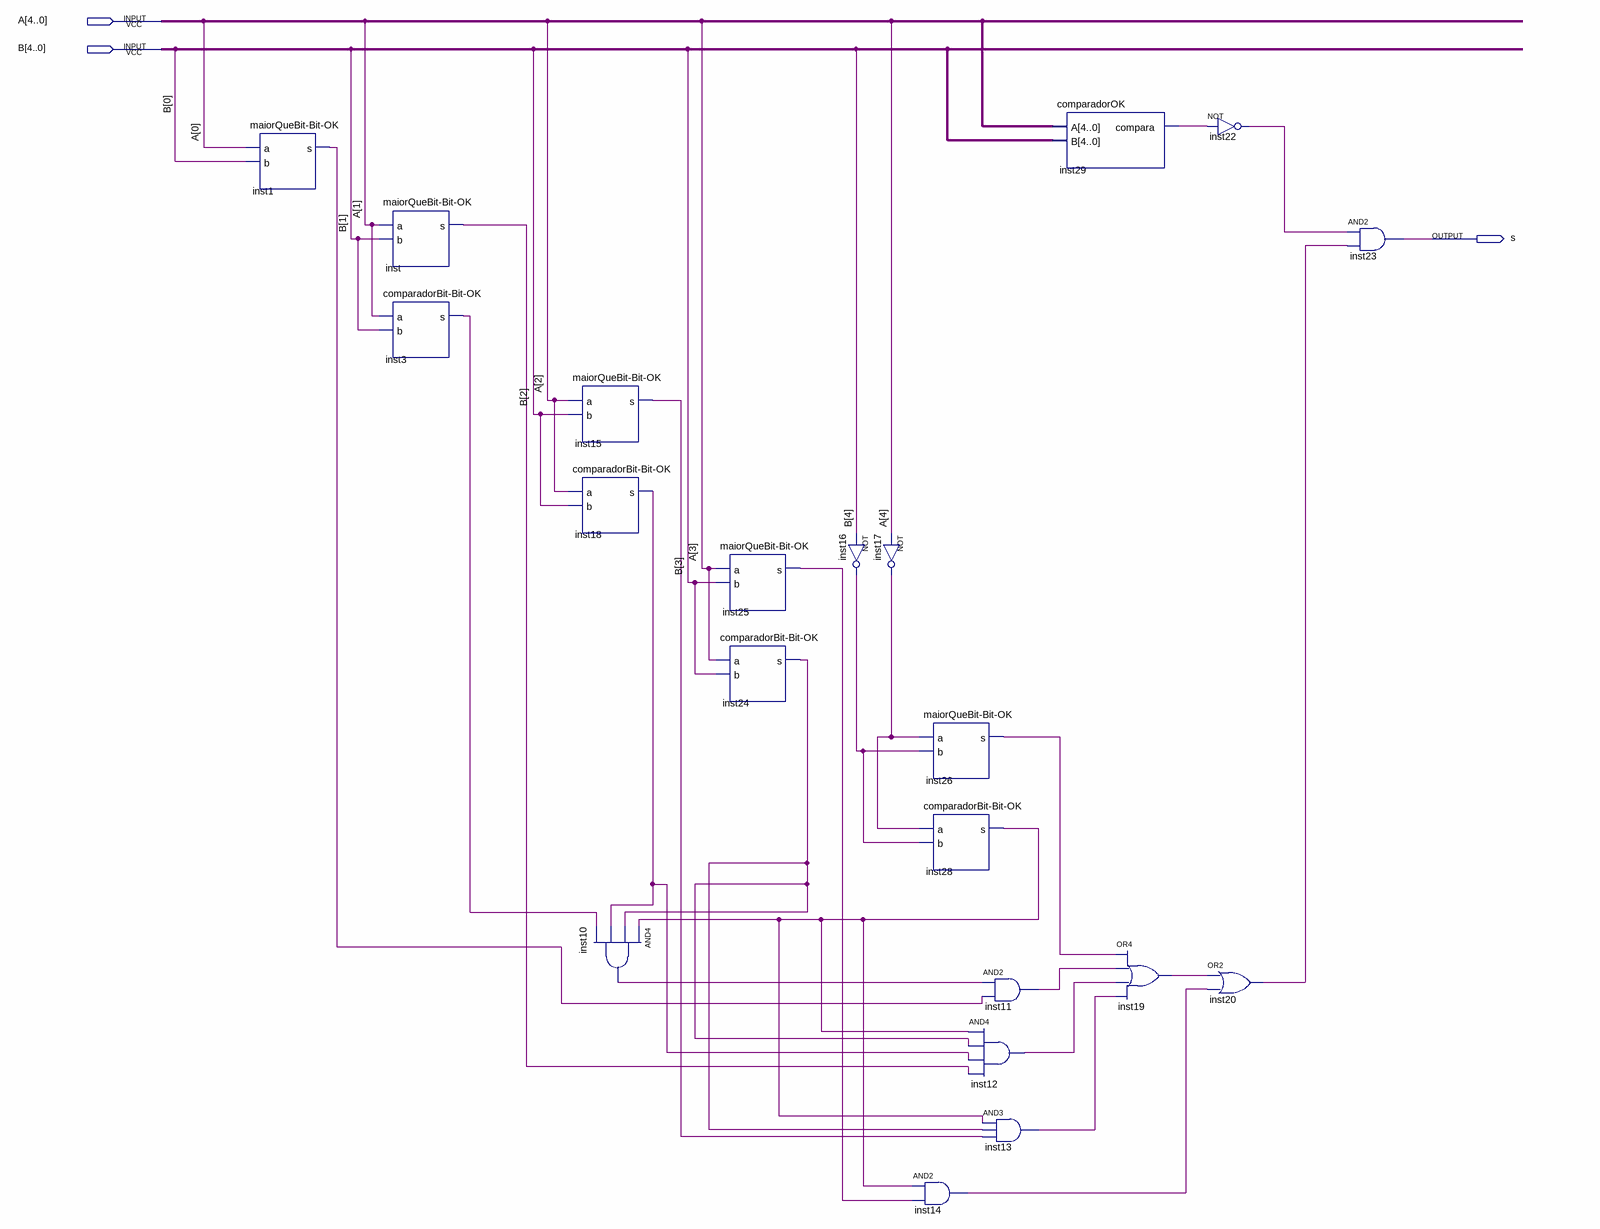
[diagram p0: schematic sheet]
// Quartus schematic maiorQueOK.bdf as structural Verilog: 21 symbols, 3 pins
module maiorQueOK (
  input  [4:0] A,
  input  [4:0] B,
  output s
);

  wire inst1_s, inst3_s, inst10_out, inst11_out, inst12_out, inst13_out, inst14_out, inst15_s, inst16_out,
       inst17_out, inst18_s, inst19_out, inst20_out, inst22_out, inst24_s, inst25_s, inst26_s, inst28_s,
       inst29_compara, inst_s;

  \maiorQueBit-Bit-OK  inst1 (.a(A[0]), .b(B[0]), .s(inst1_s));
  \maiorQueBit-Bit-OK  inst (.a(A[1]), .b(B[1]), .s(inst_s));
  \comparadorBit-Bit-OK  inst3 (.a(A[1]), .b(B[1]), .s(inst3_s));
  \maiorQueBit-Bit-OK  inst15 (.a(A[2]), .b(B[2]), .s(inst15_s));
  \comparadorBit-Bit-OK  inst18 (.a(A[2]), .b(B[2]), .s(inst18_s));
  and inst10 (inst10_out, inst28_s, inst24_s, inst18_s, inst3_s);
  \maiorQueBit-Bit-OK  inst25 (.a(A[3]), .b(B[3]), .s(inst25_s));
  \comparadorBit-Bit-OK  inst24 (.a(A[3]), .b(B[3]), .s(inst24_s));
  not inst16 (inst16_out, B[4]);
  not inst17 (inst17_out, A[4]);
  \maiorQueBit-Bit-OK  inst26 (.a(inst17_out), .b(inst16_out), .s(inst26_s));
  \comparadorBit-Bit-OK  inst28 (.a(inst17_out), .b(inst16_out), .s(inst28_s));
  and inst14 (inst14_out, inst28_s, inst25_s);
  and inst12 (inst12_out, inst28_s, inst24_s, inst18_s, inst_s);
  and inst11 (inst11_out, inst10_out, inst1_s);
  and inst13 (inst13_out, inst28_s, inst24_s, inst15_s);
  comparadorOK inst29 (.A(A), .B(B), .compara(inst29_compara));
  or inst19 (inst19_out, inst26_s, inst11_out, inst12_out, inst13_out);
  not inst22 (inst22_out, inst29_compara);
  or inst20 (inst20_out, inst19_out, inst14_out);
  and inst23 (s, inst22_out, inst20_out);
endmodule
